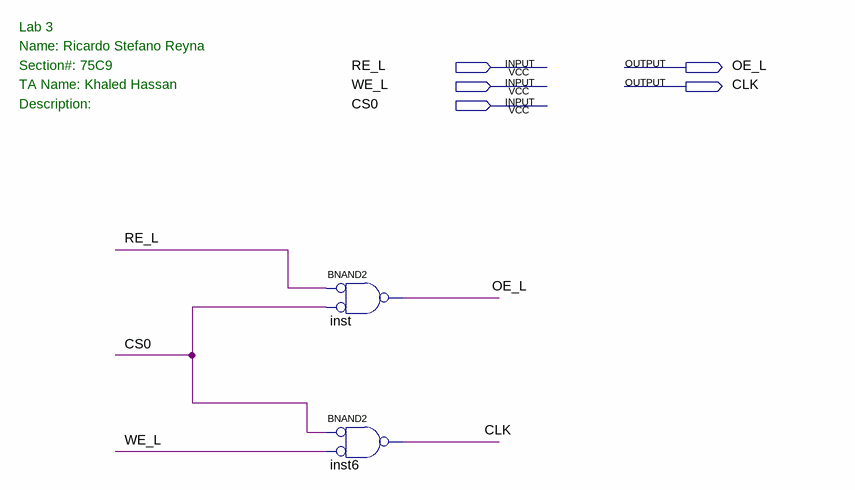
[diagram p0: schematic sheet]
// Quartus schematic Lab3_RSR.bdf as structural Verilog: 2 symbols, 5 pins
module Lab3_RSR (
  input  RE_L,
  input  WE_L,
  input  CS0,
  output OE_L,
  output CLK
);

  nand inst (OE_L, ~RE_L, ~CS0);  // BNAND2
  nand inst6 (CLK, ~CS0, ~WE_L);  // BNAND2

  // Notes on the sheet:
  //   Lab 3
  //   Name: Ricardo Stefano Reyna
  //   Section#: 75C9
  //   TA Name: Khaled Hassan
  //   Description:
endmodule
